# Altium project CONTROL BARRAS DE CONTEO.PrjPcb
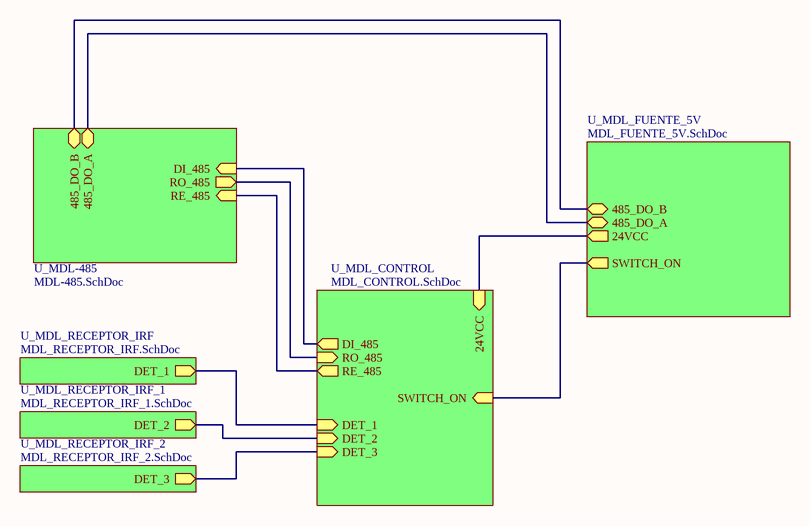
[diagram p0: CPBCC.SchDoc]
7 sheets, 66 parts. Net scope: hierarchical (ports join the sheet entries above them; power ports are global).
Board file: PCB_CPU_1.PcbDoc
Sheets:
  CPBCC.SchDoc
    U_MDL_CONTROL = MDL_CONTROL.SchDoc
    U_MDL-485 = MDL-485.SchDoc
    U_MDL_FUENTE_5V = MDL_FUENTE_5V.SchDoc
    U_MDL_RECEPTOR_IRF = MDL_RECEPTOR_IRF.SchDoc
    U_MDL_RECEPTOR_IRF_1 = MDL_RECEPTOR_IRF_1.SchDoc
    U_MDL_RECEPTOR_IRF_2 = MDL_RECEPTOR_IRF_2.SchDoc

## Sheet CPBCC.SchDoc
size A4

### Sub-sheets
U_MDL-485 = MDL-485.SchDoc: RO_485 (out), RE_485 (in), DI_485 (in), 485_DO_B (bidir), 485_DO_A (bidir)
U_MDL_CONTROL = MDL_CONTROL.SchDoc: DI_485 (out), RO_485 (in), RE_485 (out), DET_1 (in), DET_2 (in), DET_3 (in), 24VCC (in), SWITCH_ON (in)
U_MDL_FUENTE_5V = MDL_FUENTE_5V.SchDoc: 485_DO_A, SWITCH_ON (out), 485_DO_B, 24VCC (out)
U_MDL_RECEPTOR_IRF = MDL_RECEPTOR_IRF.SchDoc: DET_1 (out)
U_MDL_RECEPTOR_IRF_1 = MDL_RECEPTOR_IRF_1.SchDoc: DET_2 (out)
U_MDL_RECEPTOR_IRF_2 = MDL_RECEPTOR_IRF_2.SchDoc: DET_3 (out)

### Nets
24VCC: sheet U_MDL_CONTROL/24VCC, sheet U_MDL_FUENTE_5V/24VCC
485_DO_A: sheet U_MDL-485/485_DO_A, sheet U_MDL_FUENTE_5V/485_DO_A
485_DO_B: sheet U_MDL-485/485_DO_B, sheet U_MDL_FUENTE_5V/485_DO_B
DET_1: sheet U_MDL_CONTROL/DET_1, sheet U_MDL_RECEPTOR_IRF/DET_1
DET_2: sheet U_MDL_CONTROL/DET_2, sheet U_MDL_RECEPTOR_IRF_1/DET_2
DET_3: sheet U_MDL_CONTROL/DET_3, sheet U_MDL_RECEPTOR_IRF_2/DET_3
DI_485: sheet U_MDL_CONTROL/DI_485, sheet U_MDL-485/DI_485
PUERTA: sheet U_MDL_CONTROL/SWITCH_ON, sheet U_MDL_FUENTE_5V/SWITCH_ON
RE_485: sheet U_MDL_CONTROL/RE_485, sheet U_MDL-485/RE_485
RO_485: sheet U_MDL_CONTROL/RO_485, sheet U_MDL-485/RO_485

## Sheet MDL_CONTROL.SchDoc: CONCENTRADOR 2.0
size A3
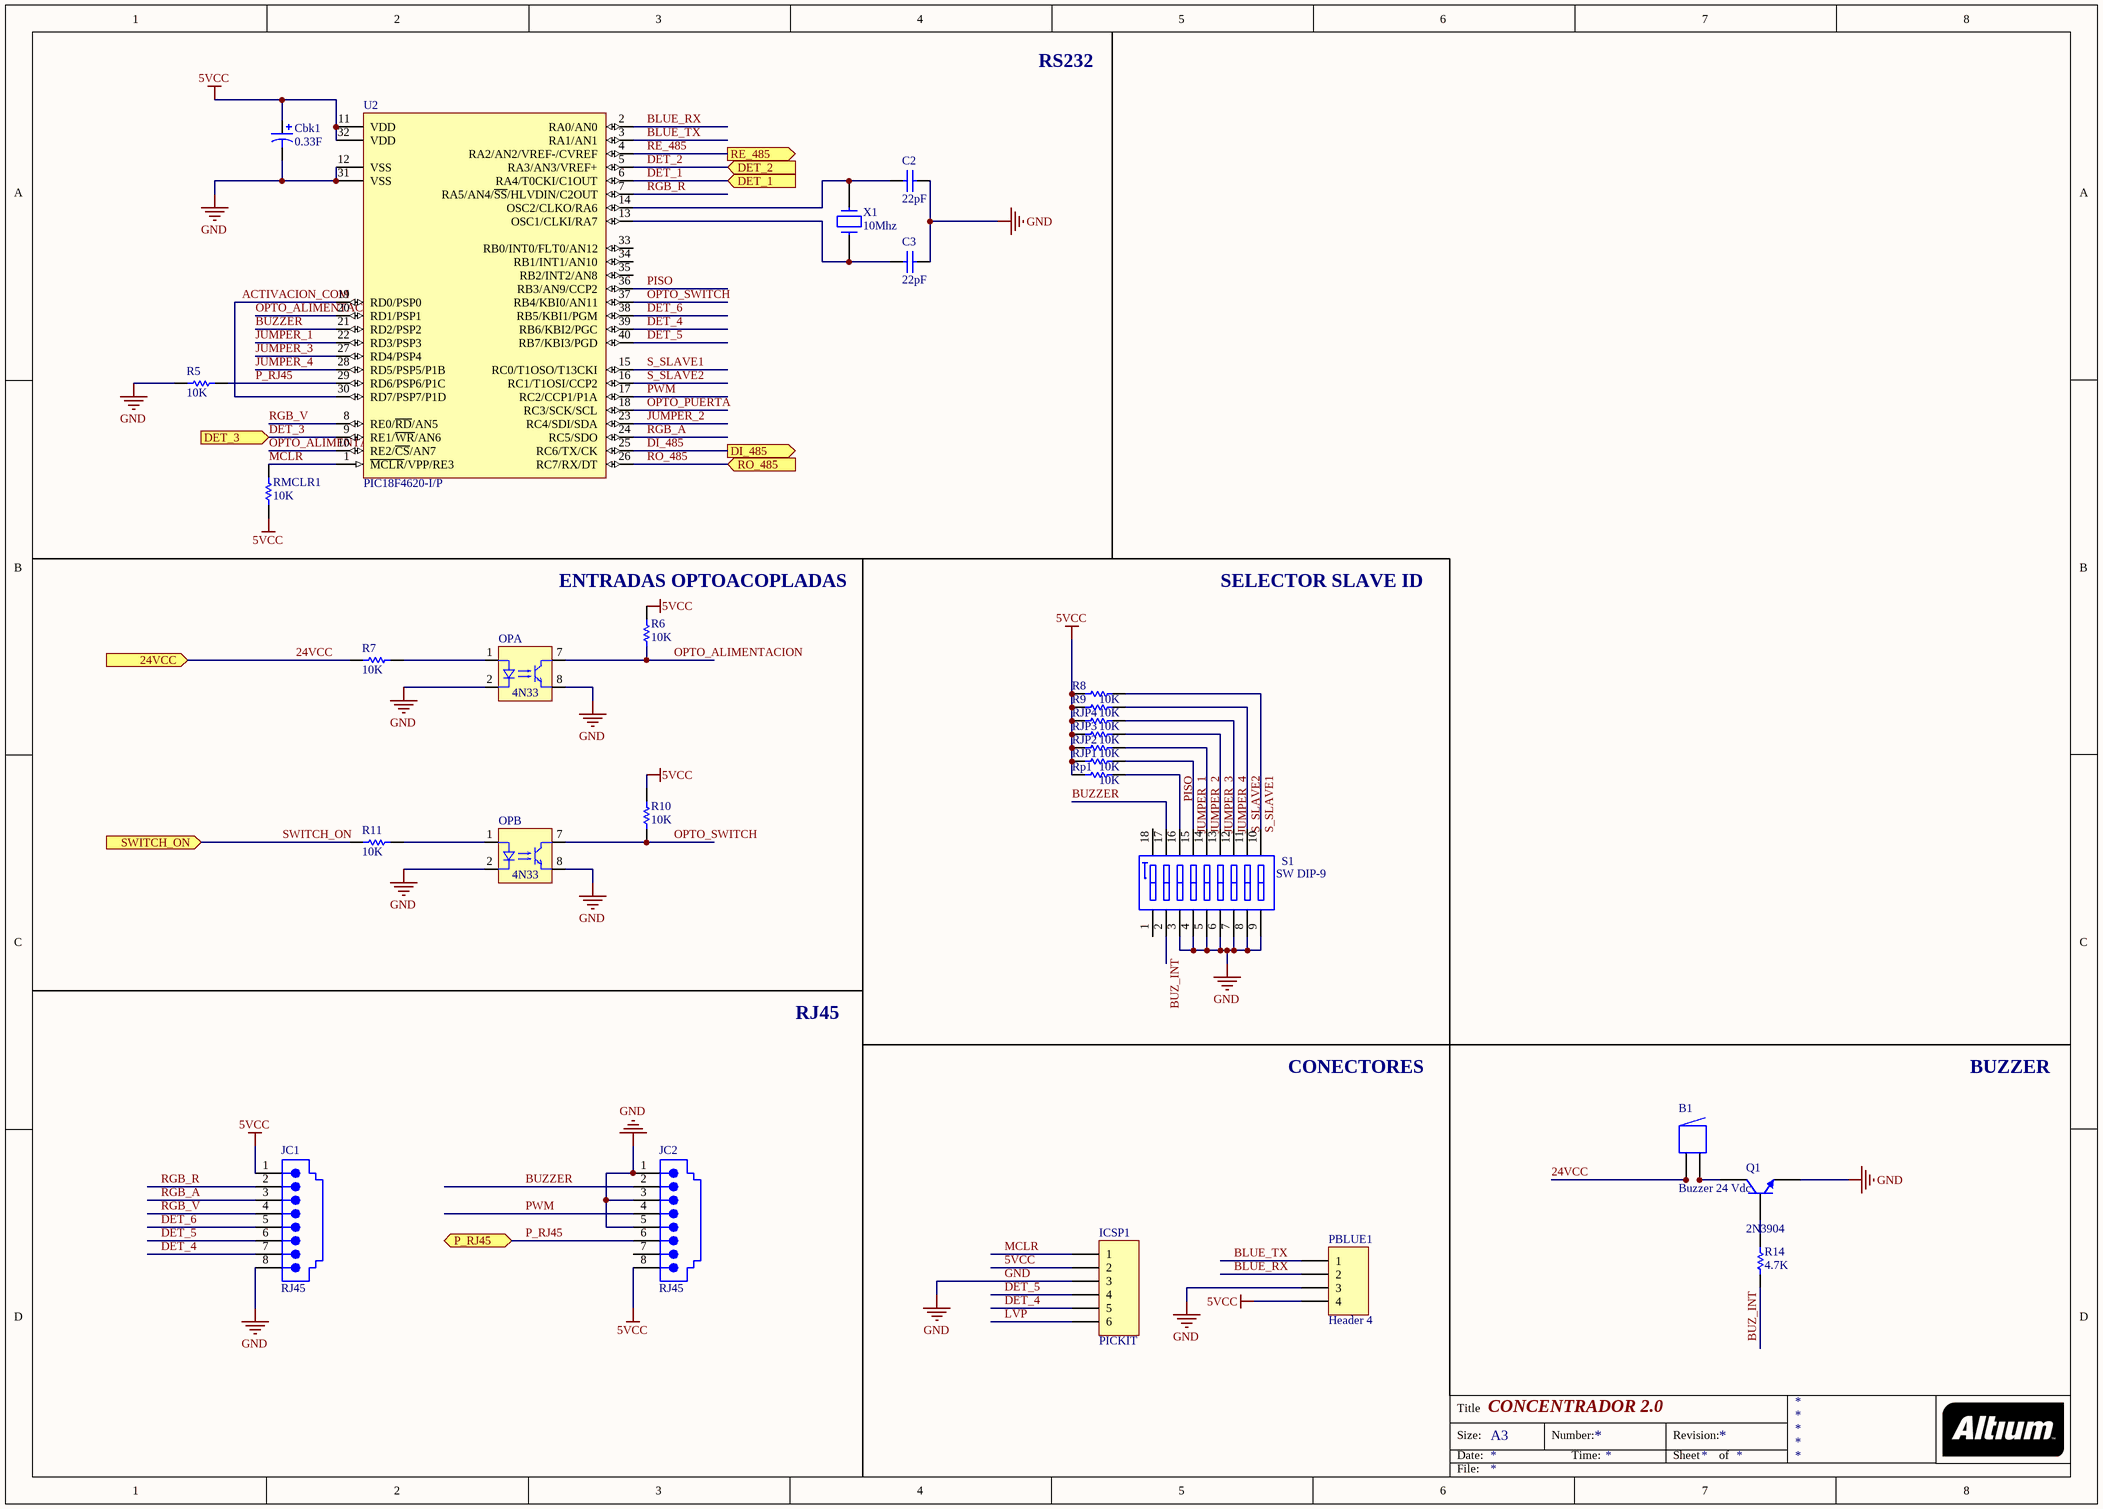
[diagram p1: MDL_CONTROL.SchDoc]

### Parts
B1  Buzzer 24 Vdc  [ABSM-1574]
C2  value 22pF  [VP31-2.5]  (hidden comment: VP31BA220JB)
C3  value 22pF  [VP31-2.5]  (hidden comment: VP31BA220JB)
Cbk1  value 0.33F  [C1000UF]  (hidden comment: Cap Pol1)
ICSP1  PICKIT  [HDR1X6]
JC1  RJ45  [15-43-6233]
JC2  RJ45  [15-43-6233]
OP  4N33  [4n35_4n33_6pines]  (parts A,B of 2)
PBLUE1  Header 4  [HDR1X4]
Q1  2N3904  [TO-92A]
R5  value 10K  [AXIAL-0.3]  (hidden comment: Res)
R6  value 10K  [AXIAL-0.3]  (hidden comment: Res)
R7  value 10K  [AXIAL-0.3]  (hidden comment: Res)
R8  value 10K  [AXIAL-0.3]  (hidden comment: Res)
R9  value 10K  [AXIAL-0.3]  (hidden comment: Res)
R10  value 10K  [AXIAL-0.3]  (hidden comment: Res)
R11  value 10K  [AXIAL-0.3]  (hidden comment: Res)
R14  value 4.7K  [AXIAL-0.3]  (hidden comment: Res)
RJP1  value 10K  [AXIAL-0.3]  (hidden comment: Res)
RJP2  value 10K  [AXIAL-0.3]  (hidden comment: Res)
RJP3  value 10K  [AXIAL-0.3]  (hidden comment: Res)
RJP4  value 10K  [AXIAL-0.3]  (hidden comment: Res)
RMCLR1  value 10K  [AXIAL-0.3]  (hidden comment: Res)
Rp1  value 10K  [AXIAL-0.3]  (hidden comment: Res)
S1  SW DIP-9  [DIP-18]
U2  PIC18F4620-I/P  [PDIP600-P40]
X1  10Mhz  [XTAL-1]

### Ports
24VCC (in), DET_1 (in), DET_2 (in), DET_3 (in), DI_485 (out), P_RJ45 (bidir), RE_485 (out), RO_485 (in), SWITCH_ON (in)

### Nets
5VCC: Cbk1.1 ICSP1.2 JC1.1 JC2.8 PBLUE1.4 R6.2 R8.2 R9.2 R10.2 RJP1.2 RJP2.2 RJP3.2 RJP4.2 RMCLR1.2 Rp1.2 U2.11(VDD) U2.32(VDD)
GND: C2.2 C3.1 Cbk1.2 ICSP1.3 JC1.8 JC2.1 JC2.3 JC2.5 OP.2(K) OP.8(E) PBLUE1.3 Q1.1(E) R5.2 S1.3(A3) S1.4(A4) S1.5(A5) S1.6(A6) S1.7(A7) S1.8(A8) S1.9(A9) U2.12(VSS) U2.31(VSS)
24VCC: B1.1 B1.1A R7.1 ; port 24VCC
ACTIVACION_COM: U2.19(RD0/PSP0) U2.30(RD7/PSP7/P1D)
BLUE_RX: PBLUE1.2 U2.2(RA0/AN0)
BLUE_TX: PBLUE1.1 U2.3(RA1/AN1)
BUZ_INT: R14.1 S1.2(A2)
BUZZER: JC2.2 S1.17(B2) U2.21(RD2/PSP2)
DET_1: U2.6(RA4/T0CKI/C1OUT) ; port DET_1
DET_2: U2.5(RA3/AN3/VREF+) ; port DET_2
DET_3: U2.9(RE1/~{WR}/AN6) ; port DET_3
DET_4: ICSP1.5 JC1.7 U2.39(RB6/KBI2/PGC)
DET_5: ICSP1.4 JC1.6 U2.40(RB7/KBI3/PGD)
DET_6: JC1.5 U2.38(RB5/KBI1/PGM)
DI_485: U2.25(RC6/TX/CK) ; port DI_485
JUMPER_1: RJP1.1 S1.15(B4) U2.22(RD3/PSP3)
JUMPER_2: RJP2.1 S1.14(B5) U2.23(RC4/SDI/SDA)
JUMPER_3: RJP3.1 S1.13(B6) U2.27(RD4/PSP4)
JUMPER_4: RJP4.1 S1.12(B7) U2.28(RD5/PSP5/P1B)
LVP: ICSP1.6
MCLR: ICSP1.1 RMCLR1.1 U2.1(~{MCLR}/VPP/RE3)
OPTO_ALIMENTACION: OP.7(C) R6.1 U2.10(RE2/~{CS}/AN7) U2.20(RD1/PSP1)
OPTO_PUERTA: U2.18(RC3/SCK/SCL)
OPTO_SWITCH: OP.7(C) R10.1 U2.37(RB4/KBI0/AN11)
P_RJ45: JC2.6 R5.1 U2.29(RD6/PSP6/P1C) ; port P_RJ45
PISO: Rp1.1 S1.16(B3) U2.36(RB3/AN9/CCP2)
PWM: JC2.4 U2.17(RC2/CCP1/P1A)
RE_485: U2.4(RA2/AN2/VREF-/CVREF) ; port RE_485
RGB_A: JC1.3 U2.24(RC5/SDO)
RGB_R: JC1.2 U2.7(RA5/AN4/~{SS}/HLVDIN/C2OUT)
RGB_V: JC1.4 U2.8(RE0/~{RD}/AN5)
RO_485: U2.26(RC7/RX/DT) ; port RO_485
S_SLAVE1: R8.1 S1.10(B9) U2.15(RC0/T1OSO/T13CKI)
S_SLAVE2: R9.1 S1.11(B8) U2.16(RC1/T1OSI/CCP2)
SWITCH_ON: R11.1 ; port SWITCH_ON  [project net PUERTA]
NetB1_2: B1.2 B1.2A Q1.3(C)
NetC2_1: C2.1 U2.14(OSC2/CLKO/RA6) X1.1
NetC3_2: C3.2 U2.13(OSC1/CLKI/RA7) X1.2
NetOP_1: OP.1(A) R7.2
NetOP_1: OP.1(A) R11.2  [a separate net that carries the same name]
NetQ1_2: Q1.2(B) R14.2

Not connected (* = marked no-connect by the designer): JC2 7; S1 1(A1) 18(B1); U2 33(RB0/INT0/FLT0/AN12) 34(RB1/INT1/AN10) 35(RB2/INT2/AN8)

### Notes on the sheet
- RS232
- (near R6) ENTRADAS OPTOACOPLADAS
- SELECTOR SLAVE ID
- RJ45
- CONECTORES
- BUZZER
- Title
- Size:
- Date:
- A3
- Number:
- Time:
- Revision:
- Sheet
- of
- File:

### Library data of the parts
B1 = Buzzer: Magnetic Transducer Buzzer; Published: 24-Mar-1999; LatestRevisionDate: 17-Dec-2003; LatestRevisionNote: Schematic revised, PCB Footprint replaced.; DatasheetVersion: 17-Dec-2003; PackageReference: ABSM-1574; Publisher: Altium Limited; PackageDescription: Magnetic Transducer Buzzer; ComponentLink1Description: Manufacturer Link; ComponentLink1URL: http://www.megastar.com/linecard/buzzmode/index.php
C2 C3 = VP31BA220JB: Dipped Radial Multilayer Ceramic Capacitor COG (NPO): 22pF, 100V; Note: See Datasheet for other packages & tolerances; Published: 17-Dec-2003; DatasheetDocument: 2-Jan-2002; PackageDocument: 8-Feb-2002; PackageReference: VP31-2.5; Publisher: Altium Limited; ComponentLink1Description: Manufacturer Link; ComponentLink1URL: http://www.vishay.com/
Cbk1 = Cap Pol1: Polarized Capacitor (Radial); Published: 8-Jun-2000; LatestRevisionDate: 17-Jul-2002; LatestRevisionNote: Re-released for DXP Platform.; PackageReference: RB7.6-15; Publisher: Altium Limited
ICSP1 = Header 6: Header, 6-Pin; LatestRevisionDate: 17-Jul-2002; LatestRevisionNote: Re-released for DXP Platform.; Publisher: Altium Limited
JC1 JC2 = 15-43-6233: Right Angle, Standard Profile, RJ45-Keyed, Flange Mount PCB Jack; Ports: 1; Positions/Loaded: Port1 - 8 Keyed/8; PerformanceCategory: 3; PCB_Mounting: Thru-Hole; ComponentAvailability: Obsolete; DrillSize: Nominal, Rounded to nearest 0.05mm; PCB_Layout: Complies with Manufacturer's Recommendation.; Published: 25-Jun-2002; DatasheetDocument: 18-Dec-2001; PackageDocument: 18-Dec-2001; PackageReference: 15-43-6233; Publisher: Altium Limited; ComponentLink1Description: Manufacturer Link; ComponentLink1URL: http://www.molex.com/; ComponentLink2Description: Datasheet; ComponentLink2URL: http://www.molex.com/cmc_upload/common_files/1212003_catalogmx41314.pdf; ComponentLink3Description: Iges Model; ComponentLink3URL: http://www.molex.com/pdm_docs/igs/15-43-6233_igs.zip
OP = ILD74: Optocoupler, Phototransistor Output, Dual Channel, TTL Compatible, Pb-free; Note: Coupling Capacitance, 0.5 pF; Note: Transfer Ratio, 35 % Typical; Published: 6-Oct-2005; DatasheetDocument: Rev. 1.4, Oct-2004; PackageDocument: Dec-2003; PackageReference: DIP8; Publisher: Altium Limited; ComponentLink1Description: Manufacturer Link; ComponentLink1URL: http://www.vishay.com/optocouplers/list/product-83640/; ComponentLink2Description: Datasheet; ComponentLink2URL: http://www.vishay.com/docs/83640/83640.pdf
PBLUE1 = Header 4: Header, 4-Pin; LatestRevisionDate: 17-Jul-2002; LatestRevisionNote: Re-released for DXP Platform.; Publisher: Altium Limited
Q1 = 2N3904: NPN General Purpose Amplifier; Published: 8-Jun-2000; LatestRevisionDate: 15-Jan-2003; LatestRevisionNote: PCB Footprint 'BCY-W3/D4.7' replaced; DatasheetVersion: 1997; PackageVersion: Sep-1998; PackageReference: TO-92A; Publisher: Altium Limited; PackageDescription: TO, Flat Index; 3 In-Line, Axial Leads; Body Dia. 4.5mm; Leads 0.51 x 0.48 mm (max); ComponentLink1Description: Manufacturer Link; ComponentLink1URL: http://www.fairchildsemi.com/; ComponentLink2Description: Datasheet; ComponentLink2URL: http://www.fairchildsemi.com/ds/2N%2F2N3904.pdf
R5-R11 R14 RJP1-RJP4 RMCLR1 Rp1 = Res1: Resistor; Published: 8-Jun-2000; LatestRevisionDate: 17-Jul-2002; LatestRevisionNote: Re-released for DXP Platform.; PackageReference: AXIAL-0.3; Publisher: Altium Limited
S1 = SW DIP-9: DIP Switch, 9 Position, SPST; Published: 24-Mar-1999; LatestRevisionDate: 17-Jul-2002; LatestRevisionNote: Re-released for DXP Platform.; PackageReference: DIP-18; Publisher: Altium Limited; Code_JEDEC: MO-036-AE
U2 = PIC18F4620-I/P: Enhanced Flash Microcontroller with 10-Bit A/D and nanoWatt Technology, 64K Flash, 40-Pin PDIP, Industrial Temperature Range; Manufacturer: Microchip; DatasheetVersion: revE, May-2008; PackageVersion: revBB, Aug-2009; PackageReference: PDIP600-P40; PackageDescription: 40-Lead Plastic Dual In-Line (P) - 600 mil Body [PDIP]; PartNumber: PIC18F4620-I/P; ComponentLink1Description: Manufacturer URL; ComponentLink1URL: http://www.microchip.com/; ComponentLink2Description: Datasheet; ComponentLink2URL: http://ww1.microchip.com/downloads/en/DeviceDoc/39626e.pdf; ComponentLink3Description: Package Specification; ComponentLink3URL: http://www.microchip.com/stellent/groups/techpub_sg/documents/packagingspec/en012702.pdf
X1 = Cristal de cuarzo: X1: 10Mhz

## Sheet MDL-485.SchDoc
size A4; DocumentNumber: 4; SheetNumber: 4
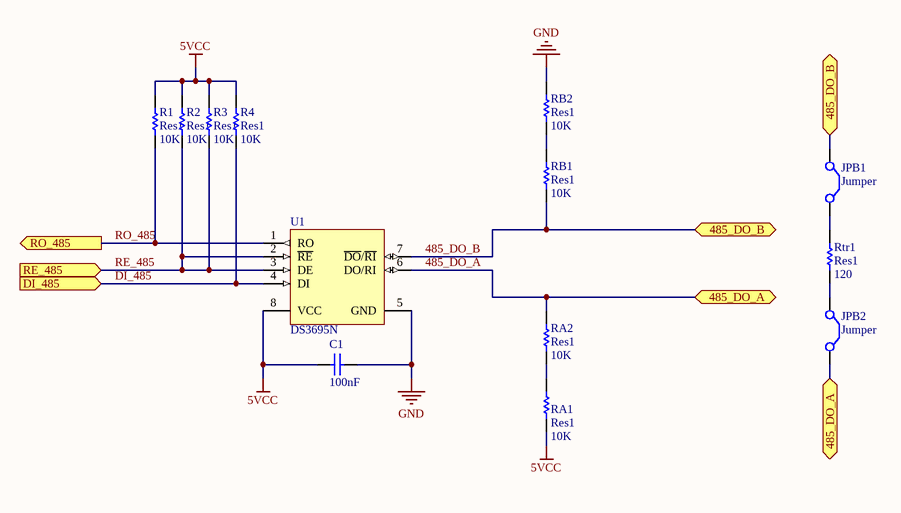
[diagram p2: MDL-485.SchDoc]

### Parts
C1  value 100nF  [VP44-2.5]  (hidden comment: VP44BY224JB)
JPB1  Jumper  [RAD-0.2]
JPB2  Jumper  [RAD-0.2]
R1  Res1  value 10K  [AXIAL-0.3]
R2  Res1  value 10K  [AXIAL-0.3]
R3  Res1  value 10K  [AXIAL-0.3]
R4  Res1  value 10K  [AXIAL-0.3]
RA1  Res1  value 10K  [AXIAL-0.3]
RA2  Res1  value 10K  [AXIAL-0.3]
RB1  Res1  value 10K  [AXIAL-0.3]
RB2  Res1  value 10K  [AXIAL-0.3]
Rtr1  Res1  value 120  [AXIAL-0.3]
U1  DS3695N  [N08E]

### Ports
485_DO_A (bidir), 485_DO_B (bidir), DI_485 (in), RE_485 (in), RO_485 (out)

### Nets
5VCC: C1.1 R1.2 R2.2 R3.2 R4.2 RA1.1 U1.8(VCC)
GND: C1.2 RB2.2 U1.5(GND)
485_DO_A: JPB2.2(C2) RA2.2 U1.6(DO/RI) ; port 485_DO_A
485_DO_B: JPB1.1(C1) RB1.1 U1.7(~{DO}/~{RI}) ; port 485_DO_B
DI_485: R4.1 U1.4(DI) ; port DI_485
RE_485: R2.1 R3.1 U1.2(~{RE}) U1.3(DE) ; port RE_485
RO_485: R1.1 U1.1(RO) ; port RO_485
NetJPB1_2: JPB1.2(C2) Rtr1.2
NetJPB2_1: JPB2.1(C1) Rtr1.1
NetRA1_2: RA1.2 RA2.1
NetRB1_2: RB1.2 RB2.1

### Library data of the parts
C1 = VP44BY224JB: Dipped Radial Multilayer Ceramic Capacitor X7R: 220nF, 100V; Published: 17-Dec-2003; DatasheetDocument: 4-Feb-2002; PackageDocument: 4-Feb-2002; PackageReference: VP44-2.5; Publisher: Altium Limited; ComponentLink1Description: Manufacturer Link; ComponentLink1URL: http://www.vishay.com/
JPB1 JPB2 = Jumper: Jumper Wire; Published: 24-Mar-1999; LatestRevisionDate: 17-Jul-2002; LatestRevisionNote: Re-released for DXP Platform.; PackageReference: RAD-0.2; Publisher: Altium Limited; PackageDescription: Radial Cap, Thru-Hole; 2 Leads; 0.2 in Pin Spacing
R1-R4 RA1 RA2 RB1 RB2 Rtr1 = Res1: Resistor; Published: 8-Jun-2000; LatestRevisionDate: 17-Jul-2002; LatestRevisionNote: Re-released for DXP Platform.; PackageReference: AXIAL-0.3; Publisher: Altium Limited; PackageDescription: Axial Device, Thru-Hole; 2 Leads; 0.3 in Pin Spacing
U1 = DS3695N: Multipoint RS485/RS422 Transceiver/Repeater; Manufacturer: National Semiconductor; CompType: Interface IC; PackageTopMarking: NSUZXYTT*DS3695N; PowerWise: N; Published: 4-Dec-2008; DatasheetVersion: May-1998; PackageVersion: revG, May-2006; PackageReference: N08E; Publisher: Altium Limited; PackageDescription: MDIP, .365 x .250 x .130in, 8 Lead, .100in Pitch; PartNumber: DS3695N; RoHS: O; PinCount: 8; DigiKeyPartNumber: DS3695N-ND; Code_JEDEC: MS-001-BA; ComponentLink1Description: DS3695 Datasheet; ComponentLink1URL: http://www.national.com/ds/DS/DS3695.pdf; ComponentLink2Description: DS3695 Web Page; ComponentLink2URL: http://www.national.com/pf/DS/DS3695.html; ComponentLink3Description: N08E Package Page; ComponentLink3URL: http://www.national.com/packaging/folders/n08e.html

## Sheet MDL_FUENTE_5V.SchDoc
size A4
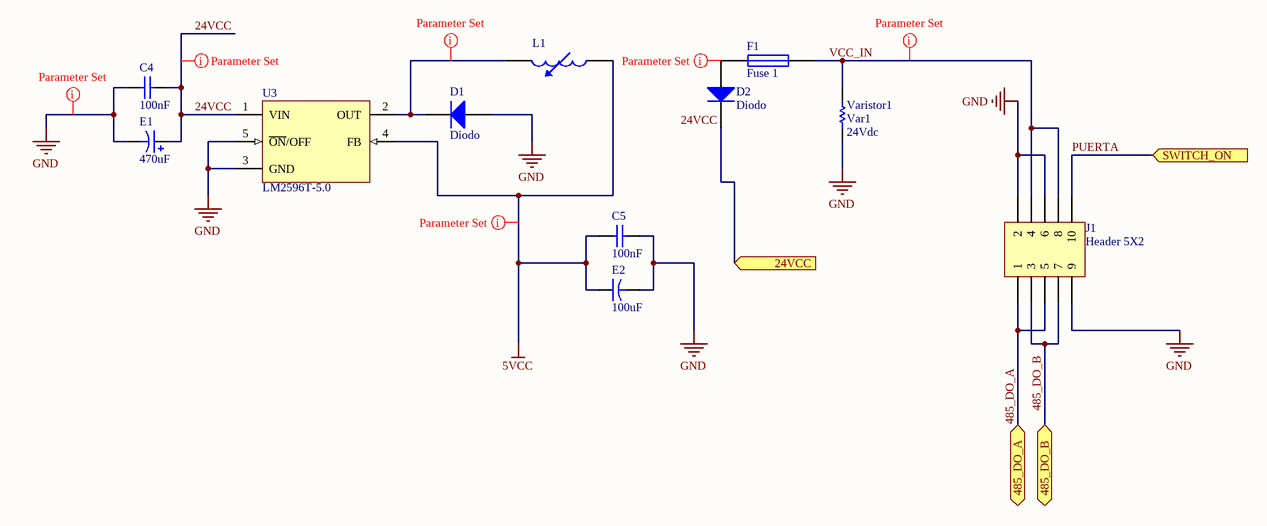
[diagram p3: MDL_FUENTE_5V.SchDoc]

### Parts
C4  value 100nF  [VP44-2.5]  (hidden comment: VP44BY224JB)
C5  value 100nF  [VP44-2.5]  (hidden comment: VP44BY224JB)
D1  Diodo  [1N4000]
D2  Diodo  [1N4000]
E1  value 470uF  [C1000UF]  (hidden comment: Cap Pol1)
E2  value 100uF  [C1UF]  (hidden comment: Cap2)
F1  Fuse 1  [FUSIBLE_BUSMATIC]
J1  Header 5X2  [FP_CON10]
L1  Inductor Adj  [Inductor_redondo]  (value not drawn)
U3  LM2596T-5.0  [FP_LM2596_D_PCB]
Varistor1  Var1  value 24Vdc  [AXIAL-0.3]

### Ports
24VCC (in), 485_DO_A, 485_DO_B, SWITCH_ON (in)

### Nets
5VCC: C5.2 E2.1 L1.1 U3.4(FB)
GND: C4.2 C5.1 D1.1(A) E1.2 E2.2 J1.2 J1.6 J1.9 U3.3(GND) U3.5(~{ON}/OFF) Varistor1.1
24VCC: D2.2(K) ; port 24VCC
24VCC: C4.1 E1.1 U3.1(VIN)  [a separate net that carries the same name]
485_DO_A: J1.1 J1.5 ; port 485_DO_A
485_DO_B: J1.3 J1.7 ; port 485_DO_B
PUERTA: J1.10 ; port SWITCH_ON
VCC_IN: F1.2 J1.4 J1.8 Varistor1.2
NetD1_2: D1.2(K) L1.2 U3.2(OUT)
NetD2_1: D2.1(A) F1.1

### Layout directives
rule Width Constraint [Pref Width = 1.2mm    Min Width = 0.8mm    Max Width = 1.5mm]: GND
rule Width Constraint [Pref Width = 1.5mm    Min Width = 1.2mm    Max Width = 2mm]: 24VCC, VCC_IN
rule Width Constraint [Pref Width = 1.2mm    Min Width = 0.8mm    Max Width = 1.5mm]; rule Undefined: 5VCC
rule Width Constraint [Pref Width = 1.5mm    Min Width = 0.8mm    Max Width = 1.5mm]: NetD1_2
rule Width Constraint [Pref Width = 1.8mm    Min Width = 1.2mm    Max Width = 2mm]: NetD2_1

### Notes on the sheet
- Labels drawn without touching a wire or pin: 24VCC

### Library data of the parts
C4 C5 = VP44BY224JB: as C1 on sheet MDL-485; Published: 17-Dec-2003; DatasheetDocument: 4-Feb-2002; PackageDocument: 4-Feb-2002; PackageReference: VP44-2.5; Publisher: Altium Limited; ComponentLink1Description: Manufacturer Link; ComponentLink1URL: http://www.vishay.com/
D1 D2 = Diodo: Diodo rectificador
E1 = Cap Pol1: Polarized Capacitor (Radial); Published: 8-Jun-2000; LatestRevisionDate: 17-Jul-2002; LatestRevisionNote: Re-released for DXP Platform.; PackageReference: RB7.6-15; Publisher: Altium Limited
E2 = Cap2: Capacitor; Published: 23-Sep-2002; PackageReference: CAPR5-4X5; Publisher: Altium Limited; PackageDescription: Capacitor; 2 Leads
F1 = Fuse 1: Fuse; Published: 8-Jun-2000; LatestRevisionDate: 17-Jul-2002; LatestRevisionNote: Re-released for DXP Platform.; PackageReference: PIN-W2/E2.8; Publisher: Altium Limited; PackageDescription: Thru-Hole; 2 Leads
J1 = Header 5X2: Header, 5-Pin, Dual row; LatestRevisionDate: 17-Jul-2002; LatestRevisionNote: Re-released for DXP Platform.; Publisher: Altium Limited
L1 = Inductor Adj: Adjustable Inductor; Value: 10mH; Set Position: 0.5; Published: 24-Mar-1999; LatestRevisionDate: 17-Jul-2002; LatestRevisionNote: Re-released for DXP Platform.; PackageReference: AXIAL-0.8; Publisher: Altium Limited
U3 = LM2596T-5.0: SIMPLE SWITCHER Power Converter 150 KHz 3A Step-Down Voltage Regulator; Manufacturer: National Semiconductor; PackageTopMarking: NSUZXYTT*LM2596T*-5.0 P+; PowerWise: N; FirstPublished: 4-Dec-2008; DatasheetVersion: May-2002; PackageVersion: revA, Oct-1989; PackageReference: T05D; Publisher: Altium Limited; PackageDescription: TO-220, Molded, Stagger Bend, 5 Lead; CompType: Switcher; PartNumber: LM2596T-5.0; RoHS: O; PinCount: 5; DigiKeyPartNumber: LM2596T-5.0-ND; ComponentLink1Description: LM2596 Datasheet; ComponentLink1URL: http://www.national.com/ds/LM/LM2596.pdf; ComponentLink2Description: LM2596 Web Page; ComponentLink2URL: http://www.national.com/pf/LM/LM2596.html; ComponentLink3Description: T05D Package Page; ComponentLink3URL: http://www.national.com/packaging/folders/t05d.html
Varistor1 = Res1: Resistor; Published: 8-Jun-2000; LatestRevisionDate: 17-Jul-2002; LatestRevisionNote: Re-released for DXP Platform.; PackageReference: AXIAL-0.3; Publisher: Altium Limited; PackageDescription: Axial Device, Thru-Hole; 2 Leads; 0.3 in Pin Spacing

## Sheet MDL_RECEPTOR_IRF.SchDoc
size A4
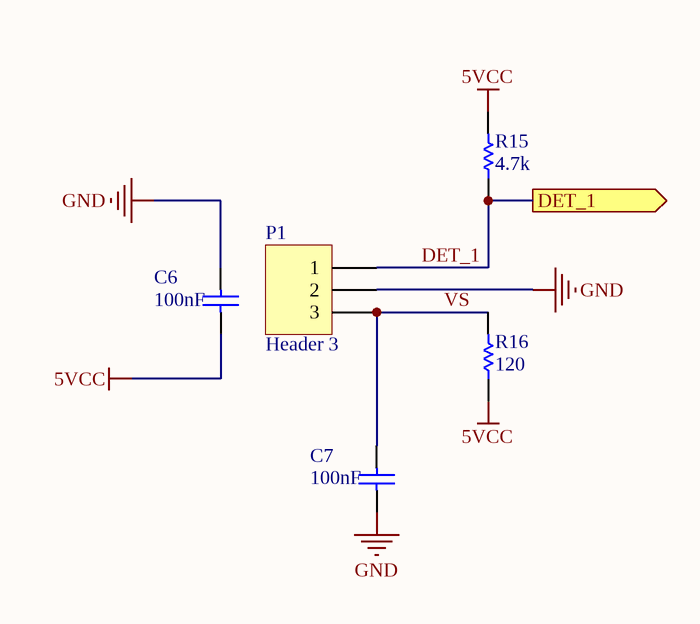
[diagram p4: MDL_RECEPTOR_IRF.SchDoc]

### Parts
C6  value 100nF  [VP44-2.5]  (hidden comment: VP44BY224JB)
C7  value 100nF  [VP44-2.5]  (hidden comment: VP44BY224JB)
P1  Header 3  [HDR1X3]
R15  value 4.7k  [AXIAL-0.3]  (hidden comment: Res)
R16  value 120  [AXIAL-0.3]  (hidden comment: Res)

### Ports
DET_1 (out)

### Nets
5VCC: C6.2 R15.2 R16.1
GND: C6.1 C7.2 P1.2
DET_1: P1.1 R15.1 ; port DET_1
VS: C7.1 P1.3 R16.2

### Library data of the parts
C6 C7 = VP44BY224JB: as C1 on sheet MDL-485; Published: 17-Dec-2003; DatasheetDocument: 4-Feb-2002; PackageDocument: 4-Feb-2002; PackageReference: VP44-2.5; Publisher: Altium Limited; ComponentLink1Description: Manufacturer Link; ComponentLink1URL: http://www.vishay.com/
P1 = Header 3: Header, 3-Pin; LatestRevisionDate: 17-Jul-2002; LatestRevisionNote: Re-released for DXP Platform.; Publisher: Altium Limited
R15 R16 = Res1: Resistor; Published: 8-Jun-2000; LatestRevisionDate: 17-Jul-2002; LatestRevisionNote: Re-released for DXP Platform.; PackageReference: AXIAL-0.3; Publisher: Altium Limited

## Sheet MDL_RECEPTOR_IRF_1.SchDoc
size A4
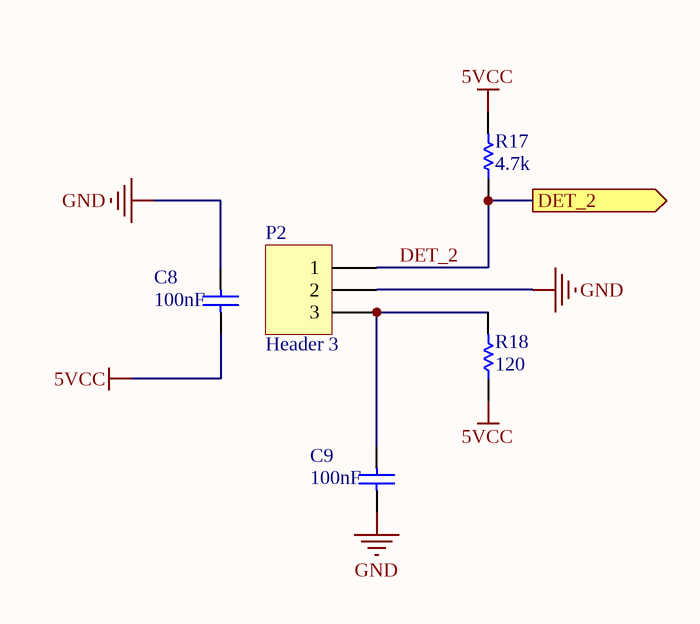
[diagram p5: MDL_RECEPTOR_IRF_1.SchDoc]

### Parts
C8  value 100nF  [VP44-2.5]  (hidden comment: VP44BY224JB)
C9  value 100nF  [VP44-2.5]  (hidden comment: VP44BY224JB)
P2  Header 3  [HDR1X3]
R17  value 4.7k  [AXIAL-0.3]  (hidden comment: Res)
R18  value 120  [AXIAL-0.3]  (hidden comment: Res)

### Ports
DET_2 (out)

### Nets
5VCC: C8.2 R17.2 R18.1
GND: C8.1 C9.2 P2.2
DET_2: P2.1 R17.1 ; port DET_2
NetC9_1: C9.1 P2.3 R18.2

### Library data of the parts
C8 C9 = VP44BY224JB: as C1 on sheet MDL-485; Published: 17-Dec-2003; DatasheetDocument: 4-Feb-2002; PackageDocument: 4-Feb-2002; PackageReference: VP44-2.5; Publisher: Altium Limited; ComponentLink1Description: Manufacturer Link; ComponentLink1URL: http://www.vishay.com/
P2 = Header 3: Header, 3-Pin; LatestRevisionDate: 17-Jul-2002; LatestRevisionNote: Re-released for DXP Platform.; Publisher: Altium Limited
R17 R18 = Res1: Resistor; Published: 8-Jun-2000; LatestRevisionDate: 17-Jul-2002; LatestRevisionNote: Re-released for DXP Platform.; PackageReference: AXIAL-0.3; Publisher: Altium Limited

## Sheet MDL_RECEPTOR_IRF_2.SchDoc
size A4
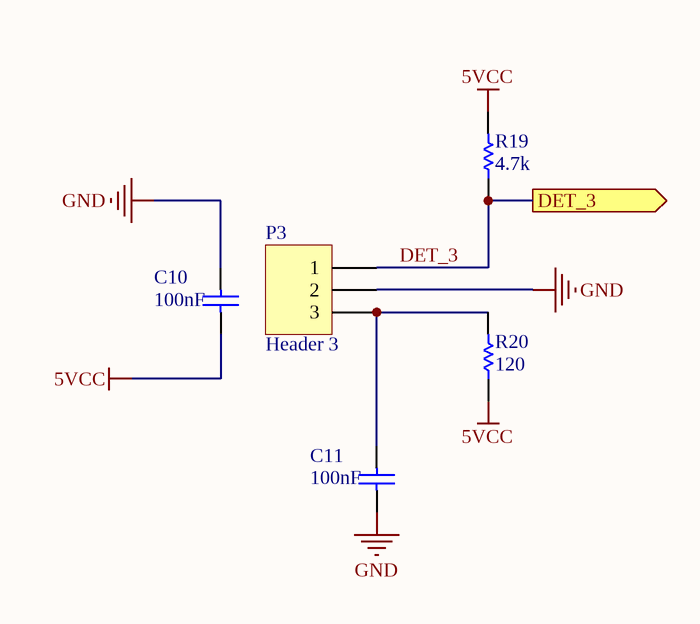
[diagram p6: MDL_RECEPTOR_IRF_2.SchDoc]

### Parts
C10  value 100nF  [VP44-2.5]  (hidden comment: VP44BY224JB)
C11  value 100nF  [VP44-2.5]  (hidden comment: VP44BY224JB)
P3  Header 3  [HDR1X3]
R19  value 4.7k  [AXIAL-0.3]  (hidden comment: Res)
R20  value 120  [AXIAL-0.3]  (hidden comment: Res)

### Ports
DET_3 (out)

### Nets
5VCC: C10.2 R19.2 R20.1
GND: C10.1 C11.2 P3.2
DET_3: P3.1 R19.1 ; port DET_3
NetC11_1: C11.1 P3.3 R20.2

### Library data of the parts
C10 C11 = VP44BY224JB: as C1 on sheet MDL-485; Published: 17-Dec-2003; DatasheetDocument: 4-Feb-2002; PackageDocument: 4-Feb-2002; PackageReference: VP44-2.5; Publisher: Altium Limited; ComponentLink1Description: Manufacturer Link; ComponentLink1URL: http://www.vishay.com/
P3 = Header 3: Header, 3-Pin; LatestRevisionDate: 17-Jul-2002; LatestRevisionNote: Re-released for DXP Platform.; Publisher: Altium Limited
R19 R20 = Res1: Resistor; Published: 8-Jun-2000; LatestRevisionDate: 17-Jul-2002; LatestRevisionNote: Re-released for DXP Platform.; PackageReference: AXIAL-0.3; Publisher: Altium Limited

## Nets that join several sheets
5VCC: MDL_CONTROL (17 pins), MDL-485 (7 pins), MDL_FUENTE_5V (C5.2 E2.1 L1.1 U3.4), MDL_RECEPTOR_IRF (C6.2 R15.2 R16.1), MDL_RECEPTOR_IRF_1 (C8.2 R17.2 R18.1), MDL_RECEPTOR_IRF_2 (C10.2 R19.2 R20.1)
GND: MDL_CONTROL (22 pins), MDL-485 (C1.2 RB2.2 U1.5), MDL_FUENTE_5V (11 pins), MDL_RECEPTOR_IRF (C6.1 C7.2 P1.2), MDL_RECEPTOR_IRF_1 (C8.1 C9.2 P2.2), MDL_RECEPTOR_IRF_2 (C10.1 C11.2 P3.2)
24VCC: MDL_CONTROL (B1.1 B1.1A R7.1), MDL_FUENTE_5V (D2.2)
485_DO_A: MDL-485 (JPB2.2 RA2.2 U1.6), MDL_FUENTE_5V (J1.1 J1.5)
485_DO_B: MDL-485 (JPB1.1 RB1.1 U1.7), MDL_FUENTE_5V (J1.3 J1.7)
DET_1: MDL_CONTROL (U2.6), MDL_RECEPTOR_IRF (P1.1 R15.1)
DET_2: MDL_CONTROL (U2.5), MDL_RECEPTOR_IRF_1 (P2.1 R17.1)
DET_3: MDL_CONTROL (U2.9), MDL_RECEPTOR_IRF_2 (P3.1 R19.1)
DI_485: MDL_CONTROL (U2.25), MDL-485 (R4.1 U1.4)
PUERTA: MDL_CONTROL (R11.1), MDL_FUENTE_5V (J1.10)
RE_485: MDL_CONTROL (U2.4), MDL-485 (R2.1 R3.1 U1.2 U1.3)
RO_485: MDL_CONTROL (U2.26), MDL-485 (R1.1 U1.1)